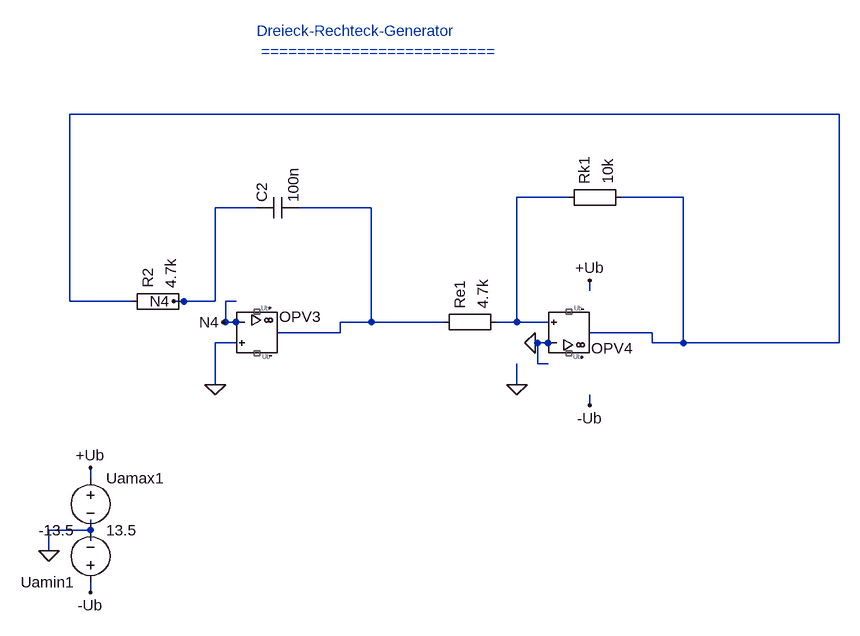
[diagram p0: schematic 9_5_Dreieck-Rechteck-Generator.asc]
9_5_Dreieck-Rechteck-Generator.asc, the LTspice schematic file:
Version 4
SHEET 1 880 680
WIRE 480 528 464 528
WIRE 464 528 464 496
WIRE 464 496 480 496
WIRE 544 544 640 544
WIRE 640 544 640 528
WIRE 576 352 592 352
WIRE 960 560 944 560
WIRE 944 560 944 592
WIRE 944 592 960 592
WIRE 1024 544 1120 544
WIRE 1120 544 1120 560
WIRE 256 848 256 832
WIRE 256 848 256 864
WIRE 880 528 912 528
WIRE 640 528 688 528
WIRE 448 496 400 496
WIRE 512 352 448 352
WIRE 448 352 448 496
WIRE 688 528 800 528
WIRE 592 352 688 352
WIRE 688 352 688 528
WIRE 1072 336 1168 336
WIRE 1168 336 1168 560
WIRE 480 560 448 560
WIRE 448 560 448 624
WIRE 912 528 912 336
WIRE 912 336 992 336
WIRE 960 528 912 528
WIRE 912 592 912 624
WIRE 1168 560 1408 560
WIRE 1408 560 1408 208
WIRE 1408 208 224 208
WIRE 224 208 224 496
WIRE 224 496 320 496
WIRE 1120 560 1168 560
WIRE 256 768 256 752
WIRE 1024 464 1024 480
WIRE 1024 656 1024 640
WIRE 256 848 192 848
WIRE 192 848 192 880
WIRE 256 928 256 944
WIRE 960 560 940 560
WIRE 480 528 460 528
WIRE 400 496 384 496
FLAG 912 624 0
FLAG 448 624 0
FLAG 192 880 0
FLAG 192 880 0
FLAG 912 624 0
FLAG 448 624 0
FLAG 940 560 0
FLAG 460 528 N4
FLAG 384 496 N4
FLAG 256 752 +Ub
FLAG 1024 464 +Ub
FLAG 256 944 -Ub
FLAG 1024 656 -Ub
SYMBOL UniversalOpAmp2 512 544 R0
SYMATTR InstName OPV3
SYMATTR Value UniversalOpAmp2
SYMBOL Misc\EuropeanResistor 304 512 R270
SYMATTR InstName R2
SYMATTR Value 4.7k
SYMBOL Misc\EuropeanResistor 784 544 R270
SYMATTR InstName Re1
SYMATTR Value 4.7k
SYMBOL Misc\EuropeanResistor 976 352 R270
SYMATTR InstName Rk1
SYMATTR Value 10k
SYMBOL cap 512 368 R270
SYMATTR InstName C2
SYMATTR Value 100n
SYMBOL UniversalOpAmp2 992 544 M180
SYMATTR InstName OPV4
SYMATTR Value UniversalOpAmp2
SYMBOL voltage 256 752 R0
SYMATTR InstName Uamax1
SYMATTR Value 13.5
SYMBOL voltage 256 944 R180
SYMATTR InstName Uamin1
SYMATTR Value -13.5
TEXT 512 80 Left 2 ;Dreieck-Rechteck-Generator \n ==========================

The netlist it stands for:
* 9_5_Dreieck-Rechteck-Generator.asc
XOPV3 0 N4 NC_01 NC_02 N001 level2 UniversalOpAmp2 Avol=1Meg GBW=10Meg Slew=10Meg Ilimit=25m Rail=0 Vos=0 En=0 Enk=0 In=0 Ink=0 Rin=500Meg  ; pins In+ In- V+ V- OUT
R2 N002 N4 4.7k
Re1 N001 N003 4.7k
Rk1 N003 N002 10k
C2 N4 N001 100n
XOPV4 N003 0 NC_03 NC_04 N002 level2 UniversalOpAmp2 Avol=1Meg GBW=10Meg Slew=10Meg Ilimit=25m Rail=0 Vos=0 En=0 Enk=0 In=0 Ink=0 Rin=500Meg  ; pins In+ In- V+ V- OUT
V§Uamax1 +Ub 0 13.5
V§Uamin1 -Ub 0 -13.5
* Dreieck-Rechteck-Generator
*  ==========================
.lib UniversalOpAmp2.lib
.backanno
.end